# Altium project F407ZGT6.PrjPcb
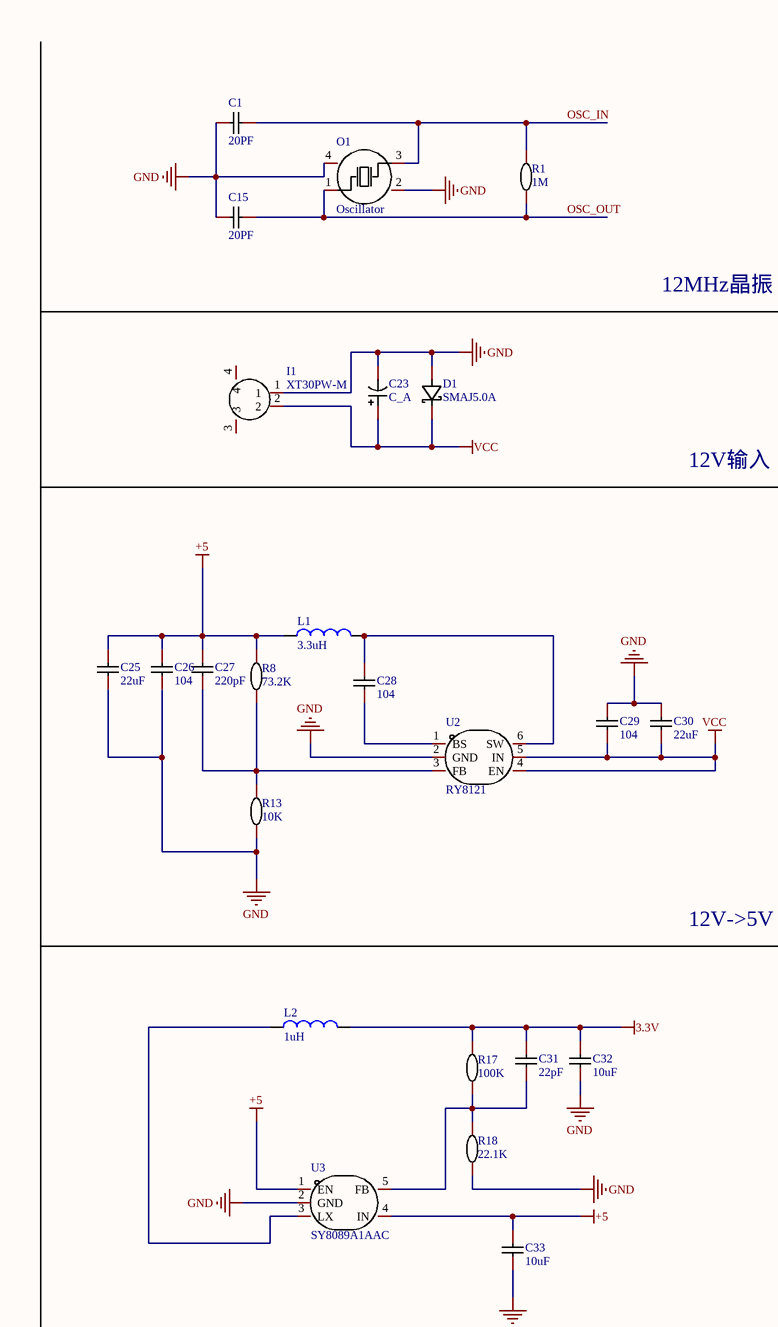
[diagram p0: Sheet1.SchDoc, top left]
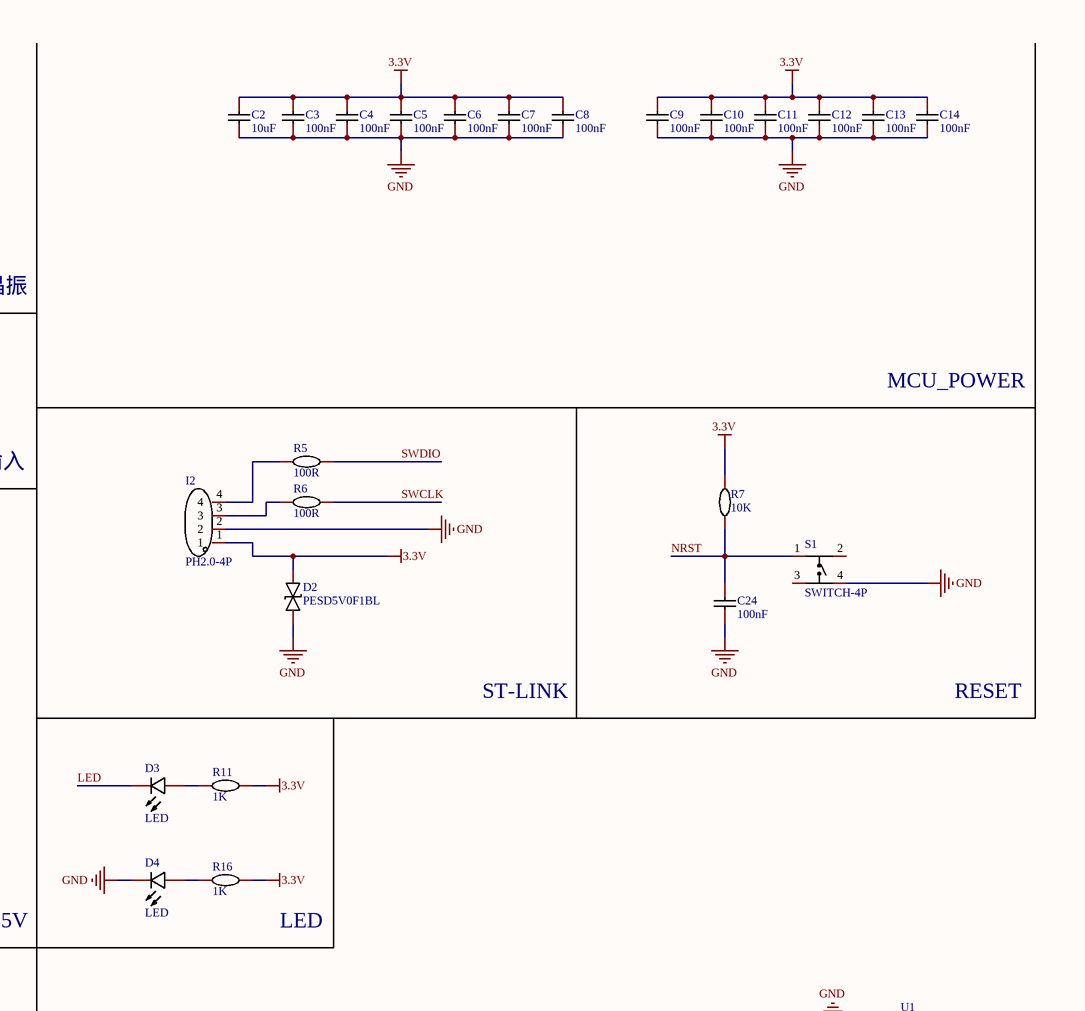
[diagram p1: Sheet1.SchDoc, top right]
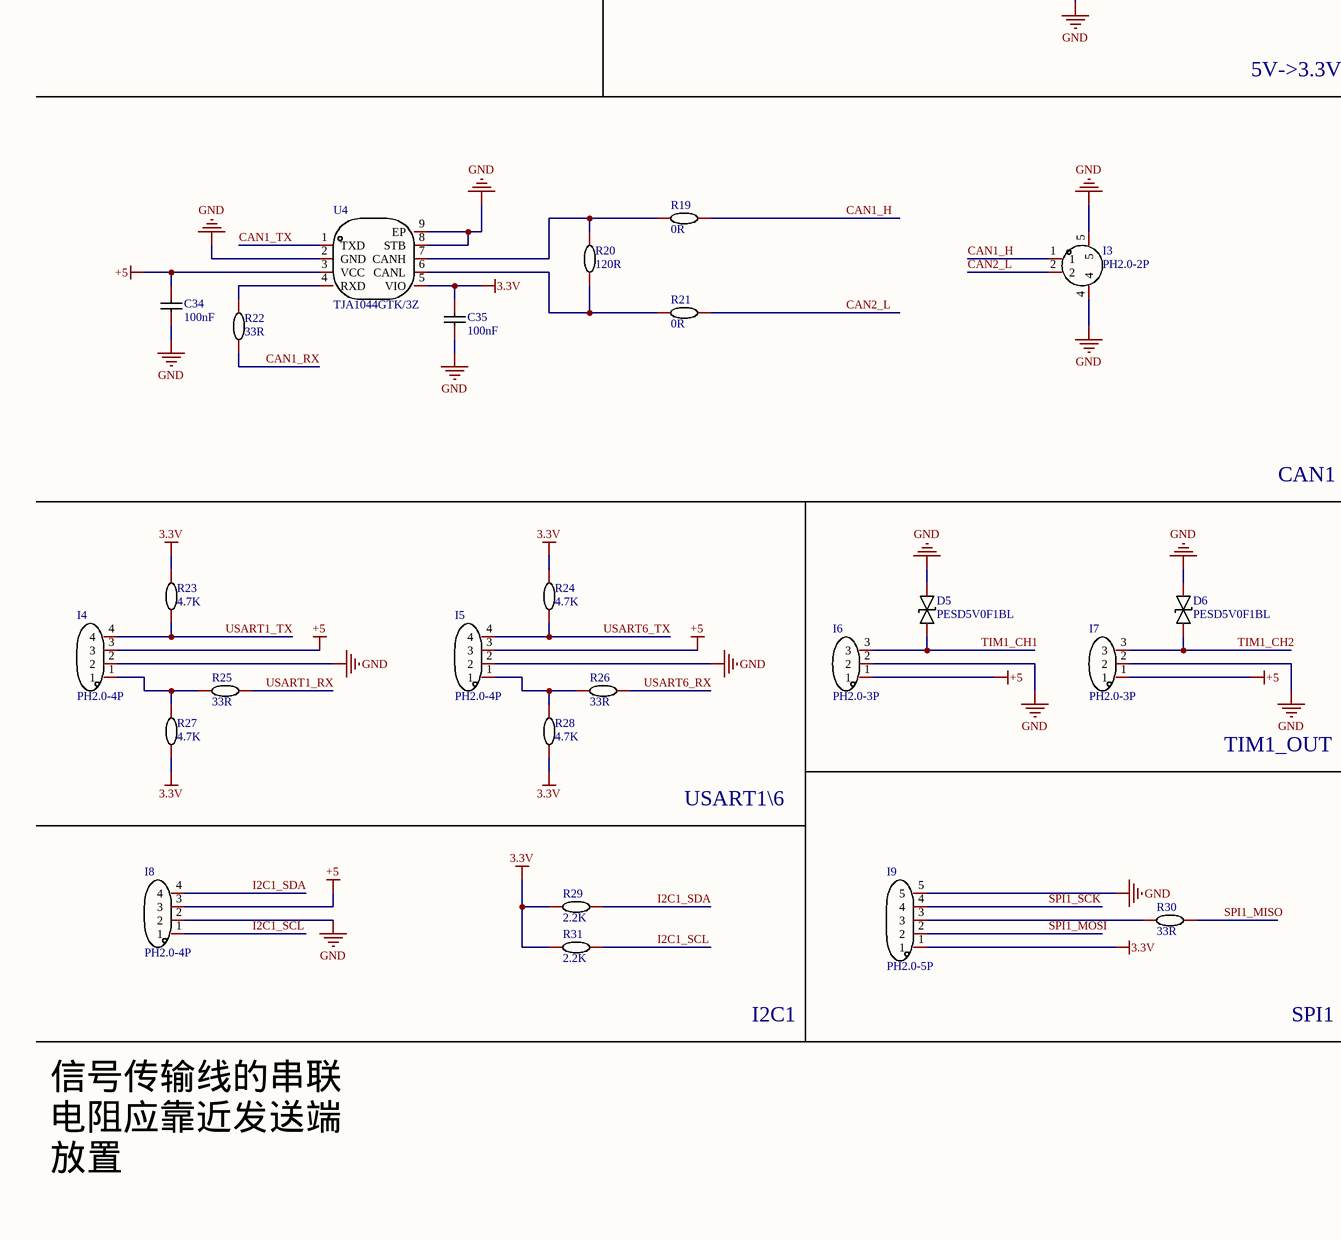
[diagram p2: Sheet1.SchDoc, bottom left]
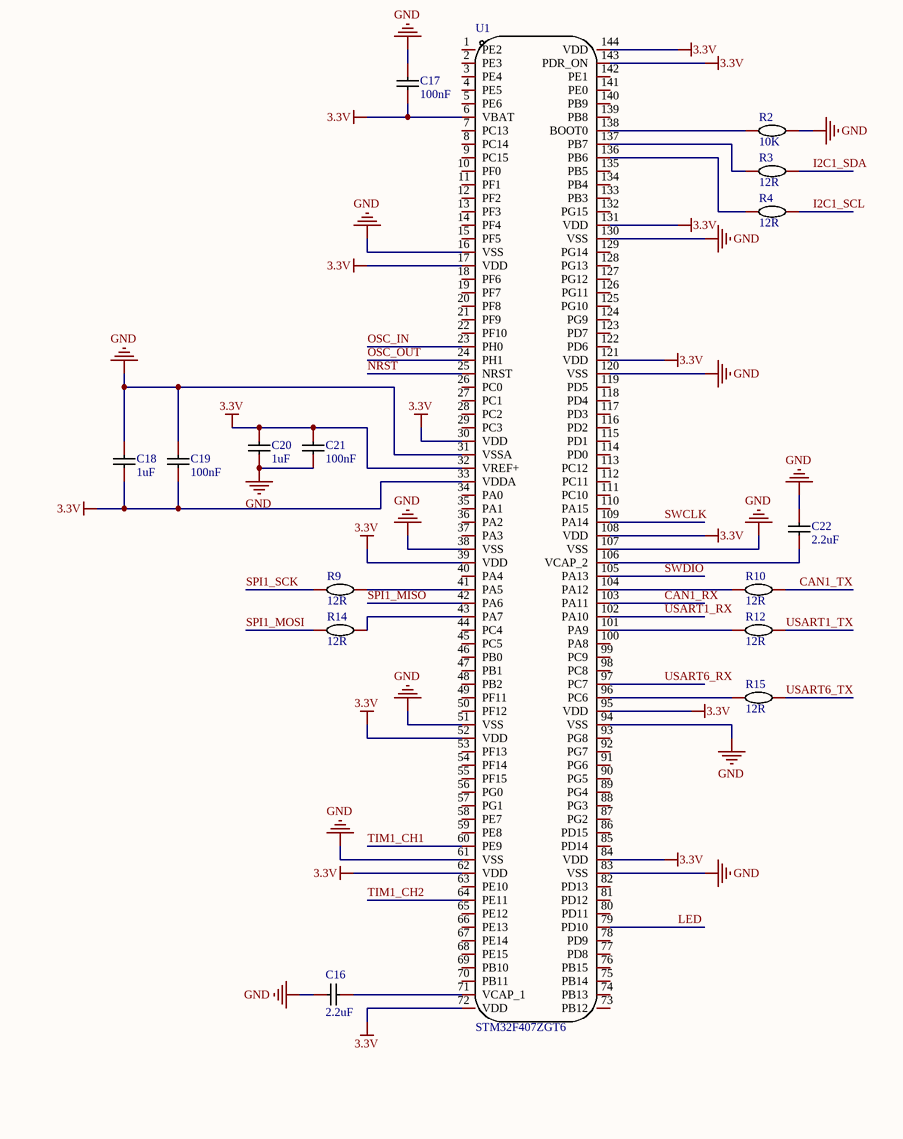
[diagram p3: Sheet1.SchDoc, bottom right]
1 sheet, 89 parts. Net scope: global (net labels, ports and power ports of the same name join across sheets).
Board file: PCB1.PcbDoc

## Sheet Sheet1.SchDoc
size A1; SheetNumber: 1; SheetTotal: 1

### Parts
C1  20PF  [C_0201]
C2  10uF  [C_0201]
C3  100nF  [C_0201]
C4  100nF  [C_0201]
C5  100nF  [C_0201]
C6  100nF  [C_0201]
C7  100nF  [C_0201]
C8  100nF  [C_0201]
C9  100nF  [C_0201]
C10  100nF  [C_0201]
C11  100nF  [C_0201]
C12  100nF  [C_0201]
C13  100nF  [C_0201]
C14  100nF  [C_0201]
C15  20PF  [C_0201]
C16  2.2uF  [C_0201]
C17  100nF  [C_0201]
C18  1uF  [C_0201]
C19  100nF  [C_0201]
C20  1uF  [C_0201]
C21  100nF  [C_0201]
C22  2.2uF  [C_0201]
C23  C_A  [C_8*10.5]
C24  100nF  [C_0201]
C25  22uF  [C_0402]
C26  104  [C_0402]
C27  220pF  [C_0402]
C28  104  [C_0402]
C29  104  [C_0402]
C30  22uF  [C_0402]
C31  22pF  [C_0603]
C32  10uF  [C_0603]
C33  10uF  [C_0603]
C34  100nF  [C_0402]
C35  100nF  [C_0402]
D1  SMAJ5.0A  [SMAJ5.0A]
D2  PESD5V0F1BL  [PESD5V0F1BL]
D3  LED  [LED_0603]
D4  LED  [LED_0603]
D5  PESD5V0F1BL  [PESD5V0F1BL]
D6  PESD5V0F1BL  [PESD5V0F1BL]
I1  XT30PW-M  [XT30PW-M]
I2  PH2.0-4P  [PH2.0-4P]
I3  PH2.0-2P  [PH2.0-2P]
I4  PH2.0-4P  [PH2.0-4P]
I5  PH2.0-4P  [PH2.0-4P]
I6  PH2.0-3P  [PH2.0-3P]
I7  PH2.0-3P  [PH2.0-3P]
I8  PH2.0-4P  [PH2.0-4P]
I9  PH2.0-5P  [PH2.0-5P]
L1  3.3uH  [L_0402]
L2  1uH  [L_0402]
O1  Oscillator  [Oscillator]
R1  1M  [R_0201]
R2  10K  [R_0402]
R3  12R  [R_0402]
R4  12R  [R_0402]
R5  100R  [R_0201]
R6  100R  [R_0201]
R7  10K  [R_0201]
R8  73.2K  [R_0603]
R9  12R  [R_0402]
R10  12R  [R_0402]
R11  1K  [R_0603]
R12  12R  [R_0402]
R13  10K  [R_0603]
R14  12R  [R_0402]
R15  12R  [R_0402]
R16  1K  [R_0603]
R17  100K  [R_0603]
R18  22.1K  [R_0603]
R19  0R  [R_0402]
R20  120R  [R_0402]
R21  0R  [R_0402]
R22  33R  [R_0402]
R23  4.7K  [R_0402]
R24  4.7K  [R_0402]
R25  33R  [R_0402]
R26  33R  [R_0402]
R27  4.7K  [R_0402]
R28  4.7K  [R_0402]
R29  2.2K  [R_0402]
R30  33R  [R_0402]
R31  2.2K  [R_0402]
S1  SWITCH-4P  [SWITCH-4P]
U1  STM32F407ZGT6  [STM32F407ZGT6]
U2  RY8121  [RY8121]
U3  SY8089A1AAC  [SY8089A1AAC]
U4  TJA1044GTK/3Z  [TJA1044GTK/3Z]

### Nets
3.3V: C2.1 C3.1 C4.1 C5.1 C6.1 C7.1 C8.1 C9.1 C10.1 C11.1 C12.1 C13.1 C14.1 C17.2 C18.1 C19.1 C20.2 C21.2 C31.2 C32.2 C35.2 D2.2 I2.1 I9.1 L2.2 R7.2 R11.2 R16.2 R17.2 R23.2 R24.2 R27.1 R28.1 R29.2 R31.2 U1.6(VBAT) U1.17(VDD) U1.30(VDD) U1.32(VREF+) U1.33(VDDA) U1.39(VDD) U1.52(VDD) U1.62(VDD) U1.72(VDD) U1.84(VDD) U1.95(VDD) U1.108(VDD) U1.121(VDD) U1.131(VDD) U1.143(PDR_ON) U1.144(VDD) U4.5(VIO)
+5: C25.2 C26.2 C27.2 C33.2 C34.2 I4.3 I5.3 I6.1 I7.1 I8.3 L1.1 R8.2 U3.1(EN) U3.4(IN) U4.3(VCC)
GND: C1.1 C2.2 C3.2 C4.2 C5.2 C6.2 C7.2 C8.2 C9.2 C10.2 C11.2 C12.2 C13.2 C14.2 C15.1 C16.1 C17.1 C18.2 C19.2 C20.1 C21.1 C22.2 C23.2 C24.1 C25.1 C26.1 C29.2 C30.2 C32.1 C33.1 C34.1 C35.1 D1.2(A) D2.1 D4.1(K) D5.2 D6.2 I1.1 I2.2 I3.4 I3.5 I4.2 I5.2 I6.2 I7.2 I8.2 I9.5 O1.2(GND) O1.4(GND) R2.1 R13.1 R18.1 S1.4 U1.16(VSS) U1.31(VSSA) U1.38(VSS) U1.51(VSS) U1.61(VSS) U1.83(VSS) U1.94(VSS) U1.107(VSS) U1.120(VSS) U1.130(VSS) U2.2(GND) U3.2(GND) U4.2(GND) U4.8(STB) U4.9(EP)
VCC: C23.1 C29.1 C30.1 D1.1(K) I1.2 U2.4(EN) U2.5(IN)
CAN1_H: I3.1 R19.1
CAN1_RX: R22.1 U1.103(PA11)
CAN1_TX: R10.1 U4.1(TXD)
CAN2_L: I3.2 R21.1
I2C1_SCL: I8.1 R4.1 R31.1
I2C1_SDA: I8.4 R3.1 R29.1
LED: D3.1(K) U1.79(PD10)
NRST: C24.2 R7.1 S1.1 U1.25(NRST)
OSC_IN: C1.2 O1.3(OSC2) R1.2 U1.23(PH0)
OSC_OUT: C15.2 O1.1(OSC1) R1.1 U1.24(PH1)
SPI1_MISO: R30.2 U1.42(PA6)
SPI1_MOSI: I9.2 R14.2
SPI1_SCK: I9.4 R9.2
SWCLK: R6.2 U1.109(PA14)
SWDIO: R5.2 U1.105(PA13)
TIM1_CH1: D5.1 I6.3 U1.60(PE9)
TIM1_CH2: D6.1 I7.3 U1.64(PE11)
USART1_RX: R25.2 U1.102(PA10)
USART1_TX: I4.4 R12.1 R23.1
USART6_RX: R26.2 U1.97(PC7)
USART6_TX: I5.4 R15.1 R24.1
NetC16_2: C16.2 U1.71(VCAP_1)
NetC22_1: C22.1 U1.106(VCAP_2)
NetC27_1: C27.1 R8.1 R13.2 U2.3(FB)
NetC28_1: C28.1 U2.1(BS)
NetC28_2: C28.2 L1.2 U2.6(SW)
NetC31_1: C31.1 R17.1 R18.2 U3.5(FB)
NetD3_2: D3.2(A) R11.1
NetD4_2: D4.2(A) R16.1
NetI2_3: I2.3 R6.1
NetI2_4: I2.4 R5.1
NetI4_1: I4.1 R25.1 R27.2
NetI5_1: I5.1 R26.1 R28.2
NetI9_3: I9.3 R30.1
NetL2_1: L2.1 U3.3(LX)
NetR2_2: R2.2 U1.138(BOOT0)
NetR3_2: R3.2 U1.137(PB7)
NetR4_2: R4.2 U1.136(PB6)
NetR9_1: R9.1 U1.41(PA5)
NetR10_2: R10.2 U1.104(PA12)
NetR12_2: R12.2 U1.101(PA9)
NetR14_1: R14.1 U1.43(PA7)
NetR15_2: R15.2 U1.96(PC6)
NetR19_2: R19.2 R20.2 U4.7(CANH)
NetR20_1: R20.1 R21.2 U4.6(CANL)
NetR22_2: R22.2 U4.4(RXD)

Not connected (* = marked no-connect by the designer): I1 3 4; S1 2 3; U1 1(PE2) 2(PE3) 3(PE4) 4(PE5) 5(PE6) 7(PC13) 8(PC14) 9(PC15) 10(PF0) 11(PF1) 12(PF2) 13(PF3) 14(PF4) 15(PF5) 18(PF6) 19(PF7) 20(PF8) 21(PF9) 22(PF10) 26(PC0) 27(PC1) 28(PC2) 29(PC3) 34(PA0) 35(PA1) 36(PA2) 37(PA3) 40(PA4) 44(PC4) 45(PC5) 46(PB0) 47(PB1) 48(PB2) 49(PF11) 50(PF12) 53(PF13) 54(PF14) 55(PF15) 56(PG0) 57(PG1) 58(PE7) 59(PE8) 63(PE10) 65(PE12) 66(PE13) 67(PE14) 68(PE15) 69(PB10) 70(PB11) 73(PB12) 74(PB13) 75(PB14) 76(PB15) 77(PD8) 78(PD9) 80(PD11) 81(PD12) 82(PD13) 85(PD14) 86(PD15) 87(PG2) 88(PG3) 89(PG4) 90(PG5) 91(PG6) 92(PG7) 93(PG8) 98(PC8) 99(PC9) 100(PA8) 110(PA15) 111(PC10) 112(PC11) 113(PC12) 114(PD0) 115(PD1) 116(PD2) 117(PD3) 118(PD4) 119(PD5) 122(PD6) 123(PD7) 124(PG9) 125(PG10) 126(PG11) 127(PG12) 128(PG13) 129(PG14) 132(PG15) 133(PB3) 134(PB4) 135(PB5) 139(PB8) 140(PB9) 141(PE0) 142(PE1)

### Notes on the sheet
- 12MHz晶振
- MCU_POWER
- 12V输入
- ST-LINK
- RESET
- 12V->5V
- (near R16) LED
- 5V->3.3V
- CAN1
- TIM1_OUT
- USART1\6
- I2C1
- SPI1
- 信号传输线的串联电阻应靠近发送端放置

### Library data of the parts
C1 C15 = C: 贴片电容
C2-C14 C16-C22 C24-C35 = C: 无极性贴片电容
C23 = C_A: 铝电解电容
D1 = SMAJ5.0A: TVS
D2 D5 D6 = PESD5V0F1BL: 双向TVS
D3 D4 = LED: 发光二极管
I1 = XT30PW-M: 卧式公头
I3 = PH2.0-2P: 卧贴
I6 I7 = PH2.0-3P: PH3.0-3P弯插
I9 = PH2.0-5P: 弯插
L1 L2 = L: SMD电感4.2*4.2*1.8
O1 = Oscillator: 晶振
R1 = R: 电阻
R2-R31 = R: 贴片电阻
U2 = RY8121: DC-DC
U3 = SY8089A1AAC: DC-DC
U4 = TJA1044GTK/3Z: CAN